# EAGLE design BackplanePowerSupply (EAGLE 7.6.0)
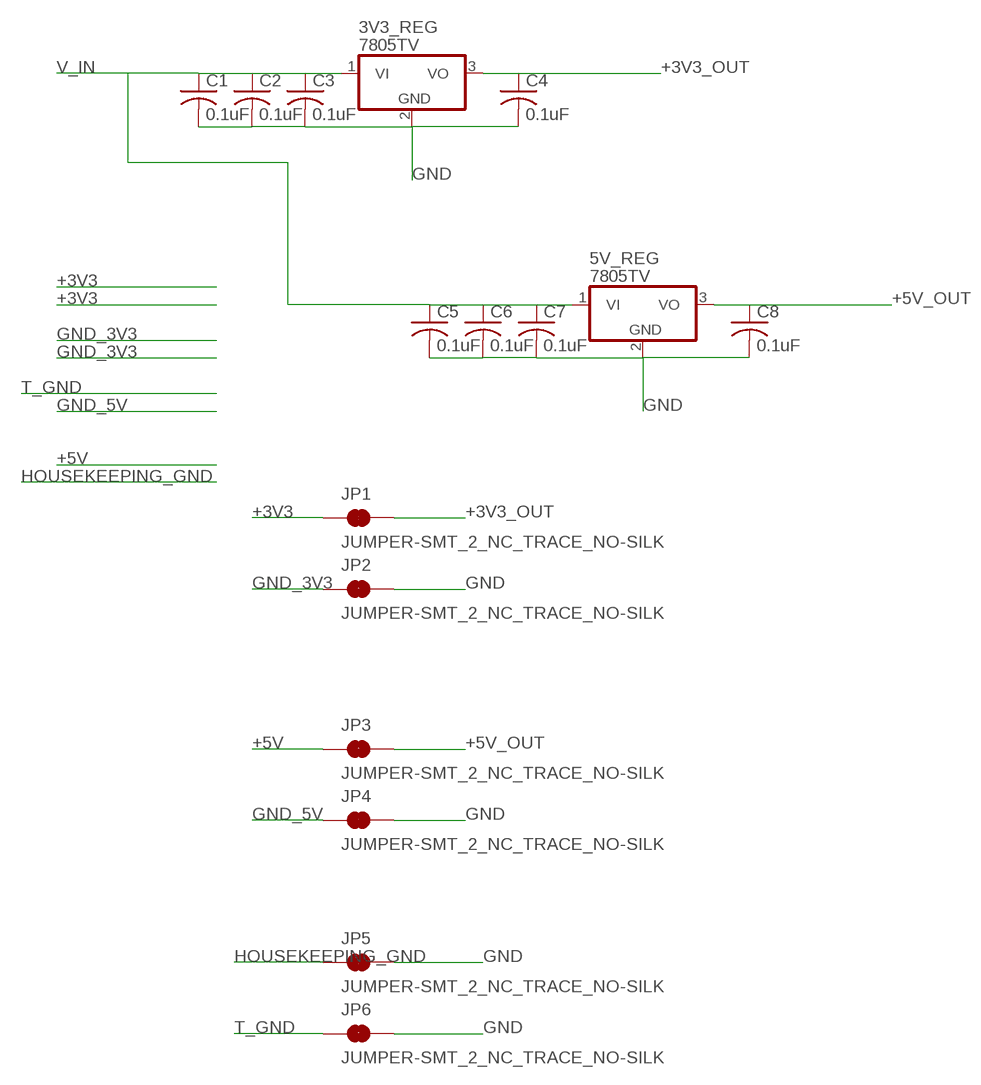
[diagram p0: schematic, sheet 1]

## Parts
3V3_REG  7805TV  [TO220V]
5V_REG  7805TV  [TO220V]
C1  0.1uF  C-US050-025X075  [C050-025X075]
C2  0.1uF  C-US050-025X075  [C050-025X075]
C3  0.1uF  C-US050-025X075  [C050-025X075]
C4  0.1uF  C-US050-025X075  [C050-025X075]
C5  0.1uF  C-US050-025X075  [C050-025X075]
C6  0.1uF  C-US050-025X075  [C050-025X075]
C7  0.1uF  C-US050-025X075  [C050-025X075]
C8  0.1uF  C-US050-025X075  [C050-025X075]
JP1  JUMPER-SMT_2_NC_TRACE_NO-SILK  [SMT-JUMPER_2_NC_TRACE_NO-SILK]
JP2  JUMPER-SMT_2_NC_TRACE_NO-SILK  [SMT-JUMPER_2_NC_TRACE_NO-SILK]
JP3  JUMPER-SMT_2_NC_TRACE_NO-SILK  [SMT-JUMPER_2_NC_TRACE_NO-SILK]
JP4  JUMPER-SMT_2_NC_TRACE_NO-SILK  [SMT-JUMPER_2_NC_TRACE_NO-SILK]
JP5  JUMPER-SMT_2_NC_TRACE_NO-SILK  [SMT-JUMPER_2_NC_TRACE_NO-SILK]
JP6  JUMPER-SMT_2_NC_TRACE_NO-SILK  [SMT-JUMPER_2_NC_TRACE_NO-SILK]

## Nets
+3V3: JP1.1
+3V3_OUT: 3V3_REG.3(VO) C4.1 JP1.2
+5V: JP3.1
+5V_OUT: 5V_REG.3(VO) C8.1 JP3.2
GND: 3V3_REG.2(GND) 5V_REG.2(GND) C1.2 C2.2 C3.2 C4.2 C5.2 C6.2 C7.2 C8.2 JP2.2 JP4.2 JP5.2 JP6.2
GND_3V3: JP2.1
GND_5V: JP4.1
HOUSEKEEPING_GND: JP5.1
T_GND: JP6.1
V_IN: 3V3_REG.1(VI) 5V_REG.1(VI) C1.1 C2.1 C3.1 C5.1 C6.1 C7.1

## Library data of the parts
3V3_REG 5V_REG = linear:78*: Positive VOLTAGE REGULATOR Source: http://cache.national.com/ds/LM/LM78L05.pdf http://www.fairchildsemi.com/ds/LM/LM7805.pdf
C1-C8 = rcl:C-US: CAPACITOR, American symbol
JP1-JP6 = SparkFun-Jumpers:JUMPER-SMT_2_NC_TRACE: Normally closed trace jumper This jumper has a trace between two pads so it's normally closed (NC). Use a razor knife to open the connection. For best results follow the IPC guidelines for cutting traces: Cutout at least 0.063 mm (0.005 in). Remove all loose material to clean up the cut area. Seal the cut with an approved epoxy. Reapply solder to reclose the connection.

## Board
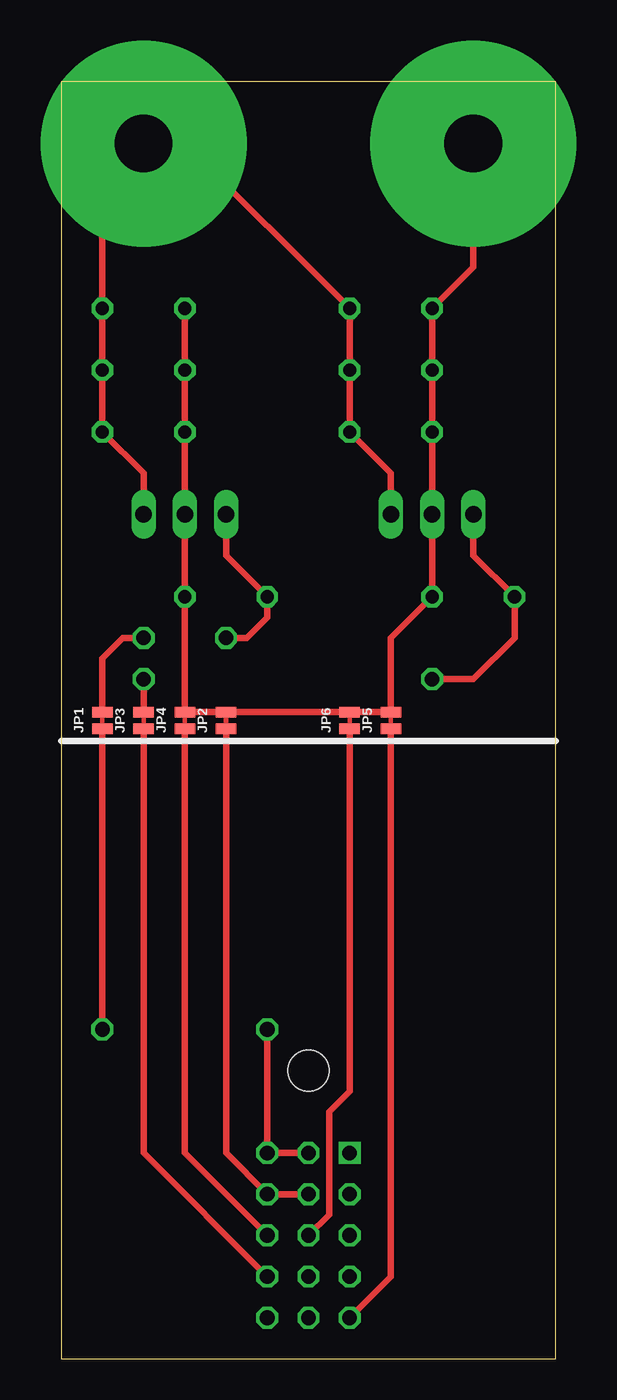
[diagram p1: board, top side]
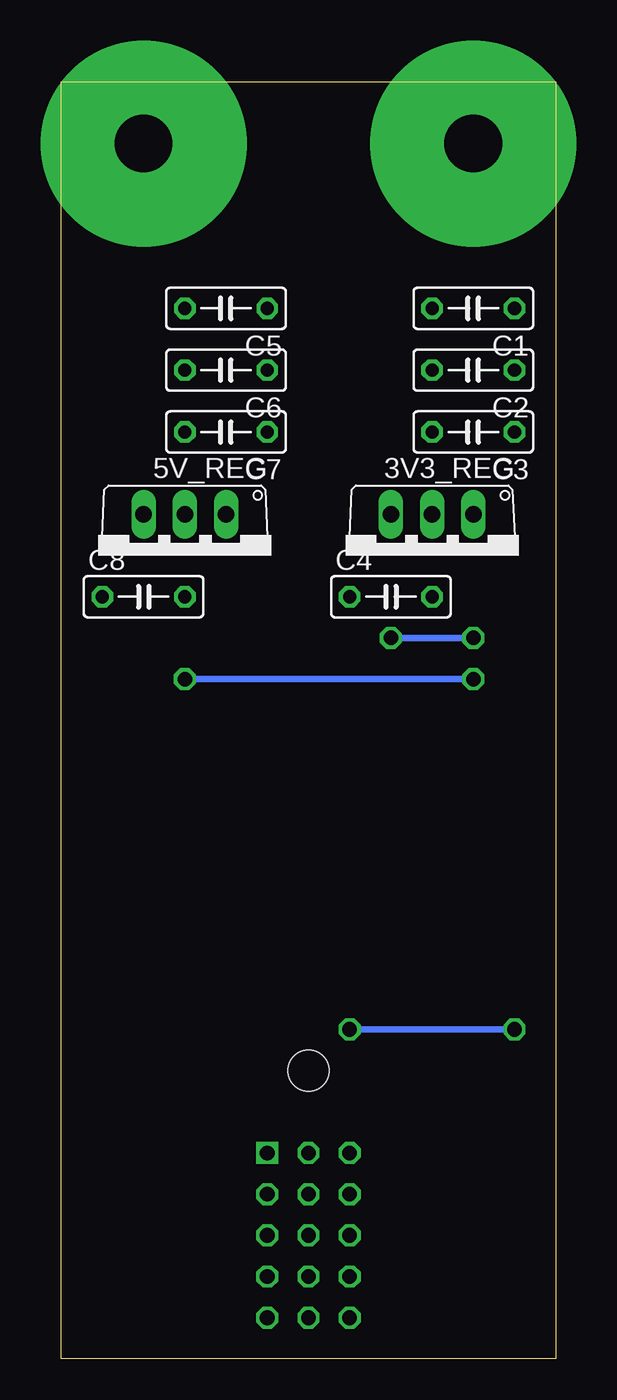
[diagram p2: board, bottom side, seen from below]

Size 30.48 x 78.74 mm. Coordinates in mm from the lower left corner, seen from the top.
Outline: 0,0 30.48,0 30.48,78.74 0,78.74 0,0
Copper layers (1*16): Top 0.035mm / dielectric 1.5mm / Bottom 0.035mm
Design rules "default": minimum track width 10mil, minimum drill 24mil, track to track 8mil, track to pad 8mil, pad to pad 8mil, via to via 8mil, smd to smd 8mil, copper to edge 40mil, drill to drill 8mil, minimum pad ring 10mil, minimum via ring 8mil, stop-mask expansion 4mil, vias tented up to drill 0mil, thermal gap 10mil
Holes 2.54 mm at 15.24,17.78

### Footprints (pad centres in the part's own frame; a part is rotated, then mirrored left to right if it is on the bottom)
TO220V = drill 1.016 long: 1 -2.54,-2.54; 2 0,-2.54; 3 2.54,-2.54
C050-025X075 = drill 0.813 octagon: 1 -2.54,0; 2 2.54,0
SMT-JUMPER_2_NC_TRACE_NO-SILK = smd 0.635 x 1.27: 1 -0.508,0; 2 0.508,0

### Placement (x,y rotation side)
3V3_REG  7.62,49.53 180 bottom
5V_REG  22.86,49.53 180 bottom
C1  5.08,64.77 180 bottom
C2  5.08,60.96 180 bottom
C3  5.08,57.15 180 bottom
C4  10.16,46.99 0 bottom
C5  20.32,64.77 180 bottom
C6  20.32,60.96 180 bottom
C7  20.32,57.15 180 bottom
C8  25.4,46.99 0 bottom
JP1  2.54,39.37 90 top
JP2  10.16,39.37 90 top
JP3  5.08,39.37 90 top
JP4  7.62,39.37 90 top
JP5  20.32,39.37 90 top
JP6  17.78,39.37 90 top

### Tracks (layer width: path | path; a pad name or v marks a point on that pad's centre or on a via)
+3V3  (via drill 0.9)
  Top 0.406: v15.24,12.7 v12.7,12.7 v12.7,20.32 | v2.54,20.32 JP1.1
  Bottom 0.406: v12.7,20.32 v2.54,20.32
+3V3_OUT  (via drill 0.9)
  Top 0.406: 3V3_REG.3 10.16,49.53 C4.1 12.7,45.72 11.43,44.45 v10.16,44.45 | JP1.2 2.54,43.18 3.81,44.45 v5.08,44.45
  Bottom 0.406: v5.08,44.45 v10.16,44.45
+5V  (via drill 0.9)
  Top 0.406: v12.7,5.08 5.08,12.7 JP3.1
+5V_OUT  (via drill 0.9)
  Top 0.406: 5V_REG.3 25.4,49.53 C8.1 27.94,44.45 25.4,41.91 v22.86,41.91 | JP3.2 v5.08,41.91
  Bottom 0.406: v5.08,41.91 v22.86,41.91
A1  (via drill 0.9)
  other vias: 17.78,12.7
A2  (via drill 0.9)
  other vias: 17.78,10.16
A3  (via drill 0.9)
  other vias: 17.78,7.62
A4  (via drill 0.9)
  other vias: 17.78,5.08
B4  (via drill 0.9)
  other vias: 15.24,5.08
B5  (via drill 0.9)
  other vias: 15.24,2.54
C5  (via drill 0.9)
  other vias: 12.7,2.54
GND  (via drill 3.56 pad 12.7)
  Top 0.406: v25.4,74.93 25.4,67.31 C5.2 C6.2 C7.2 5V_REG.2 C8.2 20.32,44.45 JP5.2 JP6.2 JP2.2 JP4.2 C4.2 3V3_REG.2 C3.2 C2.2 C1.2
GND_3V3  (via drill 0.9)
  Top 0.406: v15.24,10.16 v12.7,10.16 10.16,12.7 JP2.1
GND_5V  (via drill 0.9)
  Top 0.406: v12.7,7.62 7.62,12.7 JP4.1
HOUSEKEEPING_GND  (via drill 0.9)
  Top 0.406: v17.78,2.54 20.32,5.08 JP5.1
T_GND  (via drill 0.9)
  Top 0.406: v15.24,7.62 16.51,8.89 16.51,15.24 17.78,16.51 JP6.1
V_IN  (via drill 3.56 pad 12.7)
  Top 0.406: 3V3_REG.1 5.08,54.61 C3.1 C2.1 C1.1 2.54,72.39 v5.08,74.93 7.62,74.93 C5.1 C6.1 C7.1 20.32,54.61 5V_REG.1